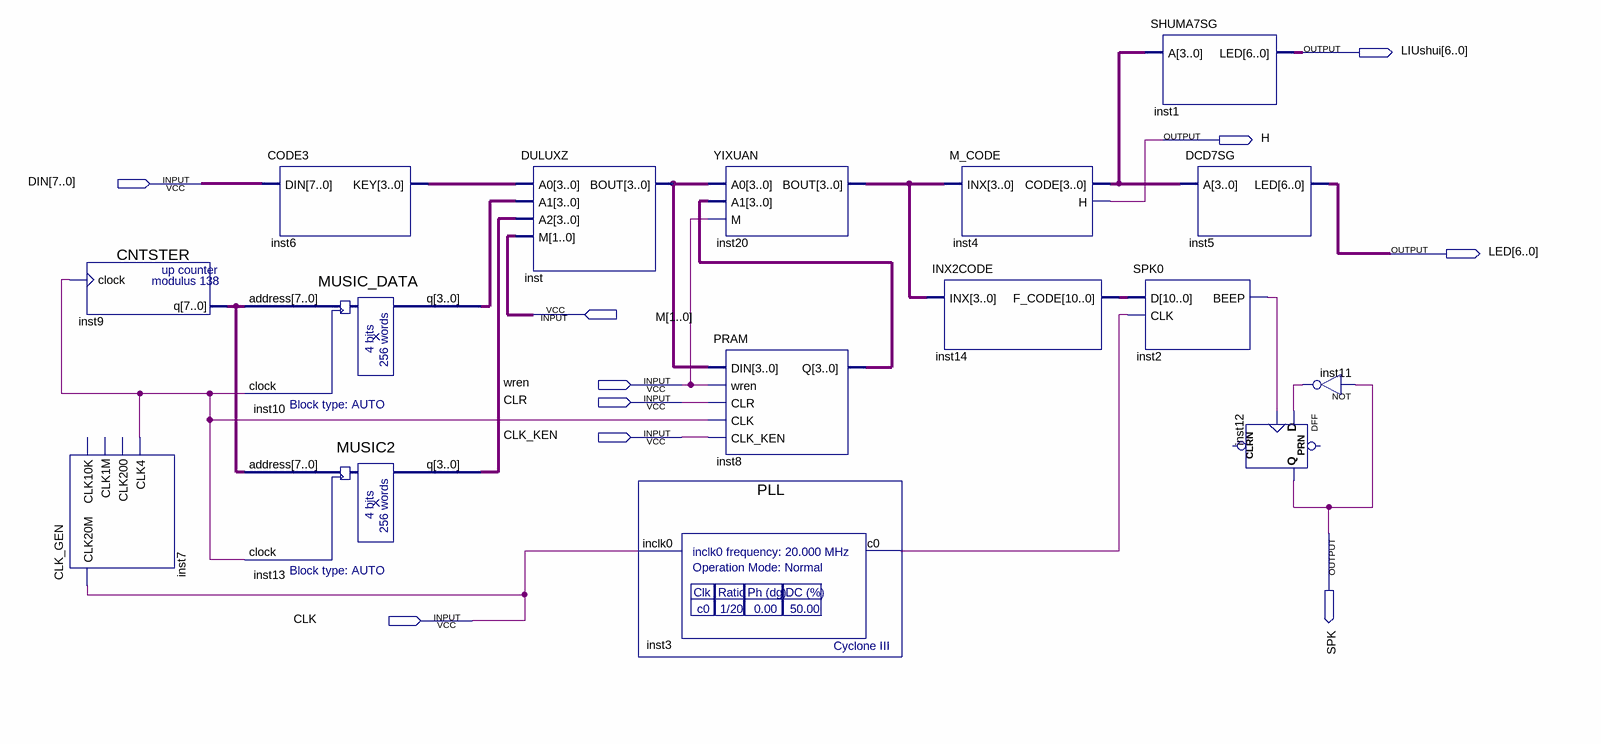
[diagram p0: schematic sheet]
// Quartus schematic kekongmusic.bdf as structural Verilog: 16 symbols, 10 pins
module kekongmusic (
  input  [7:0] DIN,
  input  [1:0] M,
  input  wren,
  input  CLR,
  input  CLK_KEN,
  input  CLK,
  output [6:0] LIUshui,
  output H,
  output [6:0] LED,
  output SPK
);

  wire inst2_beep, inst3_c0, inst7_clk4, inst11_out;
  wire [3:0] inst4_code, inst6_key, inst8_q, inst10_q, inst13_q, inst20_bout, inst_bout;
  wire [7:0] inst9_q;
  wire [10:0] inst14_f_code;

  CNTSTER inst9 (.clock(inst7_clk4), .q(inst9_q));
  CLK_GEN inst7 (.CLK20M(CLK), .CLK4(inst7_clk4));  // open: CLK10K, CLK1M, CLK200
  MUSIC_DATA inst10 (.address(inst9_q), .clock(inst7_clk4), .q(inst10_q));
  MUSIC2 inst13 (.address(inst9_q), .clock(inst7_clk4), .q(inst13_q));
  CODE3 inst6 (.DIN(DIN), .KEY(inst6_key));
  DULUXZ inst (.A0(inst6_key), .A1(inst10_q), .A2(inst13_q), .M(M), .BOUT(inst_bout));
  PLL inst3 (.inclk0(CLK), .c0(inst3_c0));
  YIXUAN inst20 (.A0(inst_bout), .A1(inst8_q), .M(wren), .BOUT(inst20_bout));
  PRAM inst8 (.DIN(inst_bout), .wren(wren), .CLR(CLR), .CLK(inst7_clk4), .CLK_KEN(CLK_KEN), .Q(inst8_q));
  M_CODE inst4 (.INX(inst20_bout), .CODE(inst4_code), .H(H));
  INX2CODE inst14 (.INX(inst20_bout), .F_CODE(inst14_f_code));
  SHUMA7SG inst1 (.A(inst4_code), .LED(LIUshui));
  SPK0 inst2 (.D(inst14_f_code), .CLK(inst3_c0), .BEEP(inst2_beep));
  DCD7SG inst5 (.A(inst4_code), .LED(LED));
  DFF inst12 (.CLK(inst2_beep), .D(inst11_out), .Q(SPK));  // open: CLRN, PRN
  not inst11 (inst11_out, SPK);
endmodule
